# EAGLE schematic PCB_ESP_BUCK_PS (EAGLE 9.6.2)
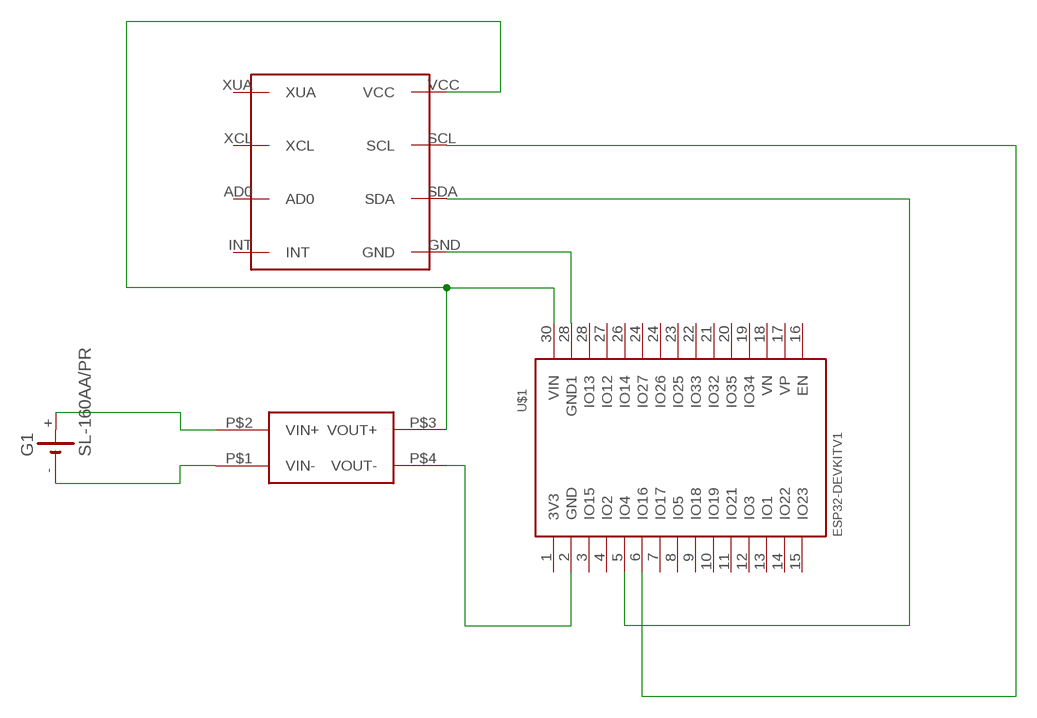
[diagram p0: schematic, sheet 1]

## Parts
G1  SL-160AA/PR  [SL-160AA/PR]
U$1  ESP32DEVKITV1  [ESP32-DEVKITV1]
U$2  MP1584-MINI  [MINI-DC-BRICK]
U$3  MPU-6050  [MPU-6050]

## Nets
N$1: G1.+ U$2.P$2(VIN+)
N$2: G1.- U$2.P$1(VIN-)
N$3: U$1.2(GND) U$2.P$4(VOUT-)
N$4: U$1.30(VIN) U$2.P$3(VOUT+) U$3.VCC
N$5: U$1.28(GND1) U$3.GND
N$6: U$1.5(IO4) U$3.SDA
N$7: U$1.6(IO16) U$3.SCL
Unconnected: U$1.1(3V3) U$1.3(IO15) U$1.4(IO2) U$1.7(IO17) U$1.8(IO5) U$1.9(IO18) U$1.10(IO19) U$1.11(IO21) U$1.12(IO3) U$1.13(IO1) U$1.14(IO22) U$1.15(IO23) U$1.16(EN) U$1.17(VP) U$1.18(VN) U$1.19(IO34) U$1.20(IO35) U$1.21(IO32) U$1.22(IO33) U$1.23(IO25) U$1.24(IO26) U$1.24(IO27) U$1.26(IO14) U$1.27(IO12) U$1.28(IO13) U$3.AD0 U$3.INT U$3.XCL U$3.XUA

## Library data of the parts
G1 = battery:SL-160AA/PR: LI BATTERY Sonnenschein
U$1 = ESP32FOOTPRINTSYMBOL:ESP32DEVKITV1
U$2 = MP1584-dc-brick:MP1584-MINI
U$3 = MPU6050:MPU-6050